# EAGLE design hwre (EAGLE 6.5.0)
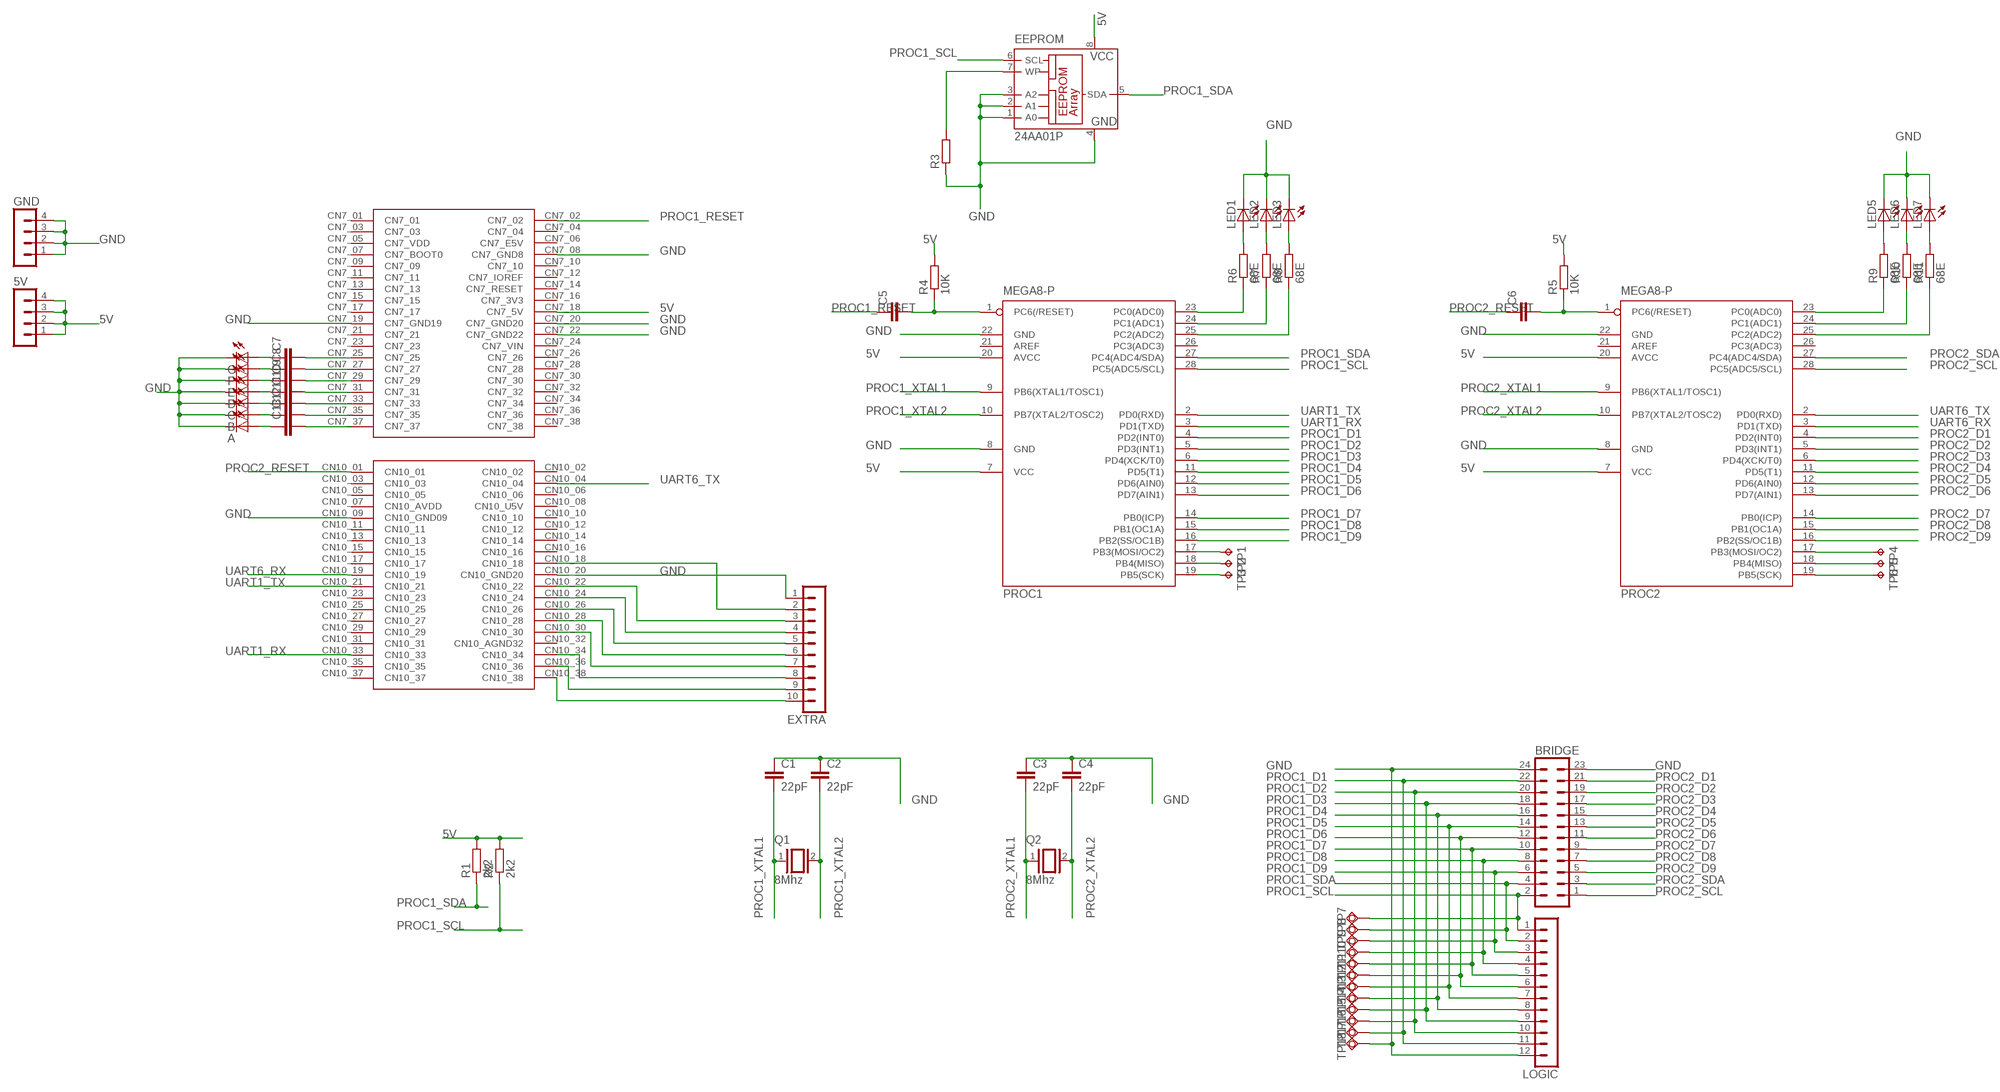
[diagram p0: schematic, sheet 1]

## Parts
5V  MA04-1  [MA04-1]
A  LEDCHIP-LED0603  [CHIP-LED0603]
B  LEDCHIP-LED0603  [CHIP-LED0603]
BRIDGE  MA12-2  [MA12-2]
C  LEDCHIP-LED0603  [CHIP-LED0603]
C1  22pF  C-EUC0603  [C0603]
C2  22pF  C-EUC0603  [C0603]
C3  22pF  C-EUC0603  [C0603]
C4  22pF  C-EUC0603  [C0603]
C5  C-EUC0603  [C0603]
C6  C-EUC0603  [C0603]
C7  C-EUC0603  [C0603]
C8  C-EUC0603  [C0603]
C9  C-EUC0603  [C0603]
C10  C-EUC0603  [C0603]
C11  C-EUC0603  [C0603]
C12  C-EUC0603  [C0603]
C13  C-EUC0603  [C0603]
D  LEDCHIP-LED0603  [CHIP-LED0603]
E  LEDCHIP-LED0603  [CHIP-LED0603]
EEPROM  24AA01P  [DIL8]
EXTRA  MA10-1  [MA10-1]
F  LEDCHIP-LED0603  [CHIP-LED0603]
G  LEDCHIP-LED0603  [CHIP-LED0603]
GND  MA04-1  [MA04-1]
LED1  LEDSML0805  [SML0805]
LED2  LEDSML0805  [SML0805]
LED3  LEDSML0805  [SML0805]
LED5  LEDSML0805  [SML0805]
LED6  LEDSML0805  [SML0805]
LED7  LEDSML0805  [SML0805]
LOGIC  MA12-1  [MA12-1]
PROC1  MEGA8-P  [DIL28-3]
PROC2  MEGA8-P  [DIL28-3]
Q1  8Mhz  XTAL/S  [QS]
Q2  8Mhz  XTAL/S  [QS]
R1  2k2  R-EU_R0603  [R0603]
R2  2k2  R-EU_R0603  [R0603]
R3  R-EU_R0603  [R0603]
R4  10K  R-EU_R0603  [R0603]
R5  10K  R-EU_R0603  [R0603]
R6  68E  R-EU_R0603  [R0603]
R7  68E  R-EU_R0603  [R0603]
R8  68E  R-EU_R0603  [R0603]
R9  68E  R-EU_R0603  [R0603]
R10  68E  R-EU_R0603  [R0603]
R11  68E  R-EU_R0603  [R0603]
TP1  TPTP20R  [TP20R]
TP2  TPTP20R  [TP20R]
TP3  TPTP20R  [TP20R]
TP4  TPTP20R  [TP20R]
TP5  TPTP20R  [TP20R]
TP6  TPTP20R  [TP20R]
TP7  TPSQTP20R  [TP20R]
TP8  TPSQTP20R  [TP20R]
TP9  TPSQTP20R  [TP20R]
TP10  TPSQTP20R  [TP20R]
TP11  TPSQTP20R  [TP20R]
TP12  TPSQTP20R  [TP20R]
TP13  TPSQTP20R  [TP20R]
TP14  TPSQTP20R  [TP20R]
TP15  TPSQTP20R  [TP20R]
TP16  TPSQTP20R  [TP20R]
TP17  TPSQTP20R  [TP20R]
TP18  TPSQTP20R  [TP20R]
U$1  NUCLEO_SHIELDGENERIC  [NUCLEO_SHIELD]

## Nets
5V: 5V.1 5V.2 5V.3 5V.4 EEPROM.8(VCC) PROC1.7(VCC) PROC1.20(AVCC) PROC2.7(VCC) PROC2.20(AVCC) R1.2 R2.2 R4.2 R5.2 U$1.CN7_18(CN7_5V)
GND: A.C B.C BRIDGE.23 BRIDGE.24 C1.1 C2.1 C3.1 C4.1 C.C D.C E.C EEPROM.1(A0) EEPROM.2(A1) EEPROM.3(A2) EEPROM.4(GND) EXTRA.1 F.C G.C GND.1 GND.2 GND.3 GND.4 LED1.C LED2.C LED3.C LED5.C LED6.C LED7.C LOGIC.12 PROC1.8(GND) PROC1.22(GND) PROC2.8(GND) PROC2.22(GND) R3.1 TP18.TP U$1.CN7_08(CN7_GND8) U$1.CN7_19(CN7_GND19) U$1.CN7_20(CN7_GND20) U$1.CN7_22(CN7_GND22) U$1.CN10_09(CN10_GND09) U$1.CN10_20(CN10_GND20)
N$1: PROC1.23(PC0(ADC0)) R6.1
N$2: PROC1.24(PC1(ADC1)) R7.1
N$3: PROC1.25(PC2(ADC2)) R8.1
N$4: LED1.A R6.2
N$5: LED2.A R7.2
N$6: EEPROM.7(WP) R3.2
N$7: LED3.A R8.2
N$8: PROC1.17(PB3(MOSI/OC2)) TP1.TP
N$9: PROC2.23(PC0(ADC0)) R9.1
N$10: PROC2.24(PC1(ADC1)) R10.1
N$11: PROC2.25(PC2(ADC2)) R11.1
N$12: LED5.A R9.2
N$13: LED6.A R10.2
N$14: LED7.A R11.2
N$15: PROC1.18(PB4(MISO)) TP2.TP
N$16: PROC1.19(PB5(SCK)) TP3.TP
N$17: PROC2.17(PB3(MOSI/OC2)) TP4.TP
N$18: PROC2.18(PB4(MISO)) TP5.TP
N$19: PROC2.19(PB5(SCK)) TP6.TP
N$20: C7.2 U$1.CN7_25
N$21: C8.2 U$1.CN7_27
N$22: C9.2 U$1.CN7_29
N$23: C10.2 U$1.CN7_31
N$24: C11.2 U$1.CN7_33
N$25: C12.2 U$1.CN7_35
N$26: C13.2 U$1.CN7_37
N$27: C7.1 G.A
N$28: C8.1 F.A
N$29: C9.1 E.A
N$30: C10.1 D.A
N$31: C11.1 C.A
N$32: B.A C12.1
N$33: A.A C13.1
N$34: EXTRA.10 U$1.CN10_38
N$35: EXTRA.9 U$1.CN10_36
N$36: EXTRA.8 U$1.CN10_34
N$37: EXTRA.7 U$1.CN10_30
N$38: EXTRA.6 U$1.CN10_28
N$39: EXTRA.5 U$1.CN10_26
N$40: EXTRA.4 U$1.CN10_24
N$41: EXTRA.3 U$1.CN10_22
N$42: EXTRA.2 U$1.CN10_18
PC6: C5.2 PROC1.1(PC6(/RESET)) R4.1
PROC1_D1: BRIDGE.22 LOGIC.11 PROC1.4(PD2(INT0)) TP17.TP
PROC1_D2: BRIDGE.20 LOGIC.10 PROC1.5(PD3(INT1)) TP16.TP
PROC1_D3: BRIDGE.18 LOGIC.9 PROC1.6(PD4(XCK/T0)) TP15.TP
PROC1_D4: BRIDGE.16 LOGIC.8 PROC1.11(PD5(T1)) TP14.TP
PROC1_D5: BRIDGE.14 LOGIC.7 PROC1.12(PD6(AIN0)) TP13.TP
PROC1_D6: BRIDGE.12 LOGIC.6 PROC1.13(PD7(AIN1)) TP12.TP
PROC1_D7: BRIDGE.10 LOGIC.5 PROC1.14(PB0(ICP)) TP11.TP
PROC1_D8: BRIDGE.8 LOGIC.4 PROC1.15(PB1(OC1A)) TP10.TP
PROC1_D9: BRIDGE.6 LOGIC.3 PROC1.16(PB2(SS/OC1B)) TP9.TP
PROC1_RESET: C5.1 U$1.CN7_02
PROC1_SCL: BRIDGE.2 EEPROM.6(SCL) LOGIC.1 PROC1.28(PC5(ADC5/SCL)) R2.1 TP7.TP
PROC1_SDA: BRIDGE.4 EEPROM.5(SDA) LOGIC.2 PROC1.27(PC4(ADC4/SDA)) R1.1 TP8.TP
PROC1_XTAL1: C1.2 PROC1.9(PB6(XTAL1/TOSC1)) Q1.1
PROC1_XTAL2: C2.2 PROC1.10(PB7(XTAL2/TOSC2)) Q1.2
PROC2_D1: BRIDGE.21 PROC2.4(PD2(INT0))
PROC2_D2: BRIDGE.19 PROC2.5(PD3(INT1))
PROC2_D3: BRIDGE.17 PROC2.6(PD4(XCK/T0))
PROC2_D4: BRIDGE.15 PROC2.11(PD5(T1))
PROC2_D5: BRIDGE.13 PROC2.12(PD6(AIN0))
PROC2_D6: BRIDGE.11 PROC2.13(PD7(AIN1))
PROC2_D7: BRIDGE.9 PROC2.14(PB0(ICP))
PROC2_D8: BRIDGE.7 PROC2.15(PB1(OC1A))
PROC2_D9: BRIDGE.5 PROC2.16(PB2(SS/OC1B))
PROC2_PC6: C6.2 PROC2.1(PC6(/RESET)) R5.1
PROC2_RESET: C6.1 U$1.CN10_01
PROC2_SCL: BRIDGE.1 PROC2.28(PC5(ADC5/SCL))
PROC2_SDA: BRIDGE.3 PROC2.27(PC4(ADC4/SDA))
PROC2_XTAL1: C3.2 PROC2.9(PB6(XTAL1/TOSC1)) Q2.1
PROC2_XTAL2: C4.2 PROC2.10(PB7(XTAL2/TOSC2)) Q2.2
UART1_RX: PROC1.3(PD1(TXD)) U$1.CN10_33
UART1_TX: PROC1.2(PD0(RXD)) U$1.CN10_21
UART6_RX: PROC2.3(PD1(TXD)) U$1.CN10_19
UART6_TX: PROC2.2(PD0(RXD)) U$1.CN10_04
Unconnected: PROC1.21(AREF) PROC1.26(PC3(ADC3)) PROC2.21(AREF) PROC2.26(PC3(ADC3)) U$1.CN7_01 U$1.CN7_03 U$1.CN7_04 U$1.CN7_05(CN7_VDD) U$1.CN7_06(CN7_E5V) U$1.CN7_07(CN7_BOOT0) U$1.CN7_09 U$1.CN7_10 U$1.CN7_11 U$1.CN7_12(CN7_IOREF) U$1.CN7_13 U$1.CN7_14(CN7_RESET) U$1.CN7_15 U$1.CN7_16(CN7_3V3) U$1.CN7_17 U$1.CN7_21 U$1.CN7_23 U$1.CN7_24(CN7_VIN) U$1.CN7_26 U$1.CN7_28 U$1.CN7_30 U$1.CN7_32 U$1.CN7_34 U$1.CN7_36 U$1.CN7_38 U$1.CN10_02 U$1.CN10_03 U$1.CN10_05 U$1.CN10_06 U$1.CN10_07(CN10_AVDD) U$1.CN10_08(CN10_U5V) U$1.CN10_10 U$1.CN10_11 U$1.CN10_12 U$1.CN10_13 U$1.CN10_14 U$1.CN10_15 U$1.CN10_16 U$1.CN10_17 U$1.CN10_23 U$1.CN10_25 U$1.CN10_27 U$1.CN10_29 U$1.CN10_31 U$1.CN10_32(CN10_AGND32) U$1.CN10_35 U$1.CN10_37

## Library data of the parts
5V GND = con-lstb:MA04-1: PIN HEADER; OC_FARNELL: unknown; OC_NEWARK: unknown
A B C D E F G LED1-LED3 LED5-LED7 = led:LED: LED OSRAM: - CHIPLED LG R971, LG N971, LY N971, LG Q971, LY Q971, LO R971, LY R971 LH N974, LH R974 LS Q976, LO Q976, LY Q976 LO Q996 - Hyper CHIPLED LW Q18S LB Q993, LB Q99A, LB R99A - SideLED LS A670, LO A670, LY A670, LG A670, LP A670 LB A673, LV A673, LT A673, LW A673 LH A674 LY A675 LS A676, LA A676, LO A676, LY A676, LW A676 LS A679, LY A679, LG A679 - Hyper Micro SIDELED® LS Y876, LA Y876, LO Y876, LY Y876 LT Y87S - SmartLED LW L88C, LW L88S LB L89C, LB L89S, LG L890 LS L89K, LO L89K, LY L89K LS L896, LA L896, LO L896, LY L896 - TOPLED LS T670, LO T670, LY T670, LG T670, LP T670 LSG T670, LSP T670, LSY T670, LOP T670, LYG T670 LG T671, LOG T671, LSG T671 LB T673, LV T673, LT T673, LW T673 LH T674 LS T676, LA T676, LO T676, LY T676, LB T676, LH T676, LSB T676, LW T676 LB T67C, LV T67C, LT T67C, LS T67K, LO T67K, LY T67K, LW E67C LS E67B, LA E67B, LO E67B, LY E67B, LB E67C, LV E67C, LT E67C LW T67C LS T679, LY T679, LG T679 LS T770, LO T770, LY T770, LG T770, LP T770 LB T773, LV T773, LT T773, LW T773 LH T774 LS E675, LA E675, LY E675, LS T675 LS T776, LA T776, LO T776, LY T776, LB T776 LHGB T686 LT T68C, LB T68C - Hyper Mini TOPLED® LB M676 - Mini TOPLED Santana® LG M470 LS M47K, LO M47K, LY M47K Source: http://www.osram.convergy.de LUXEON: - LUMILED® LXK2-PW12-R00, LXK2-PW12-S00, LXK2-PW14-U00, LXK2-PW14-V00 LXK2-PM12-R00, LXK2-PM12-S00, LXK2-PM14-U00 LXK2-PE12-Q00, LXK2-PE12-R00, LXK2-PE12-S00, LXK2-PE14-T00, LXK2-PE14-U00 LXK2-PB12-K00, LXK2-PB12-L00, LXK2-PB12-M00, LXK2-PB14-N00, LXK2-PB14-P00, LXK2-PB14-Q00 LXK2-PR12-L00, LXK2-PR12-M00, LXK2-PR14-Q00, LXK2-PR14-R00 LXK2-PD12-Q00, LXK2-PD12-R00, LXK2-PD12-S00 LXK2-PH12-R00, LXK2-PH12-S00 LXK2-PL12-P00, LXK2-PL12-Q00, LXK2-PL12-R00 Source: www.luxeon.com KINGBRIGHT: KA-3528ASYC Source: www.kingbright.com
BRIDGE = con-lstb:MA12-2: PIN HEADER; OC_FARNELL: unknown; OC_NEWARK: unknown
C1-C13 = rcl:C-EU: CAPACITOR, European symbol
EEPROM = microchip:24*: Serial EEPROM I2C; MPN: 24AA01-I/P; OC_FARNELL: 1331266; OC_NEWARK: 35M0692
EXTRA = con-lstb:MA10-1: PIN HEADER; OC_FARNELL: unknown; OC_NEWARK: unknown
LOGIC = con-lstb:MA12-1: PIN HEADER; OC_FARNELL: unknown; OC_NEWARK: unknown
PROC1 PROC2 = atmel:MEGA8-P: MICROCONTROLLER 8 Kbytes FLASH, 1 kbytes SRAM, 512 bytes EEPROM, USART, 4-channel 10 bit ADC, 2-channel 8 bit ADC Pin compatible with Atmega48, ATMega88, ATMega168 Source: avr.lbr; OC_FARNELL: unknown; OC_NEWARK: unknown
Q1 Q2 = special:XTAL/S: CRYSTAL
R1 R2 R6-R11 = rcl:R-EU_: RESISTOR, European symbol
R3-R5 = resistor:R-EU_: RESISTOR, European symbol
TP1-TP6 = testpad:TP: Test pad
TP7-TP18 = testpad:TPSQ: Test pad
U$1 = protofactory:NUCLEO_SHIELD: Generic Nucleo Shield

## Board
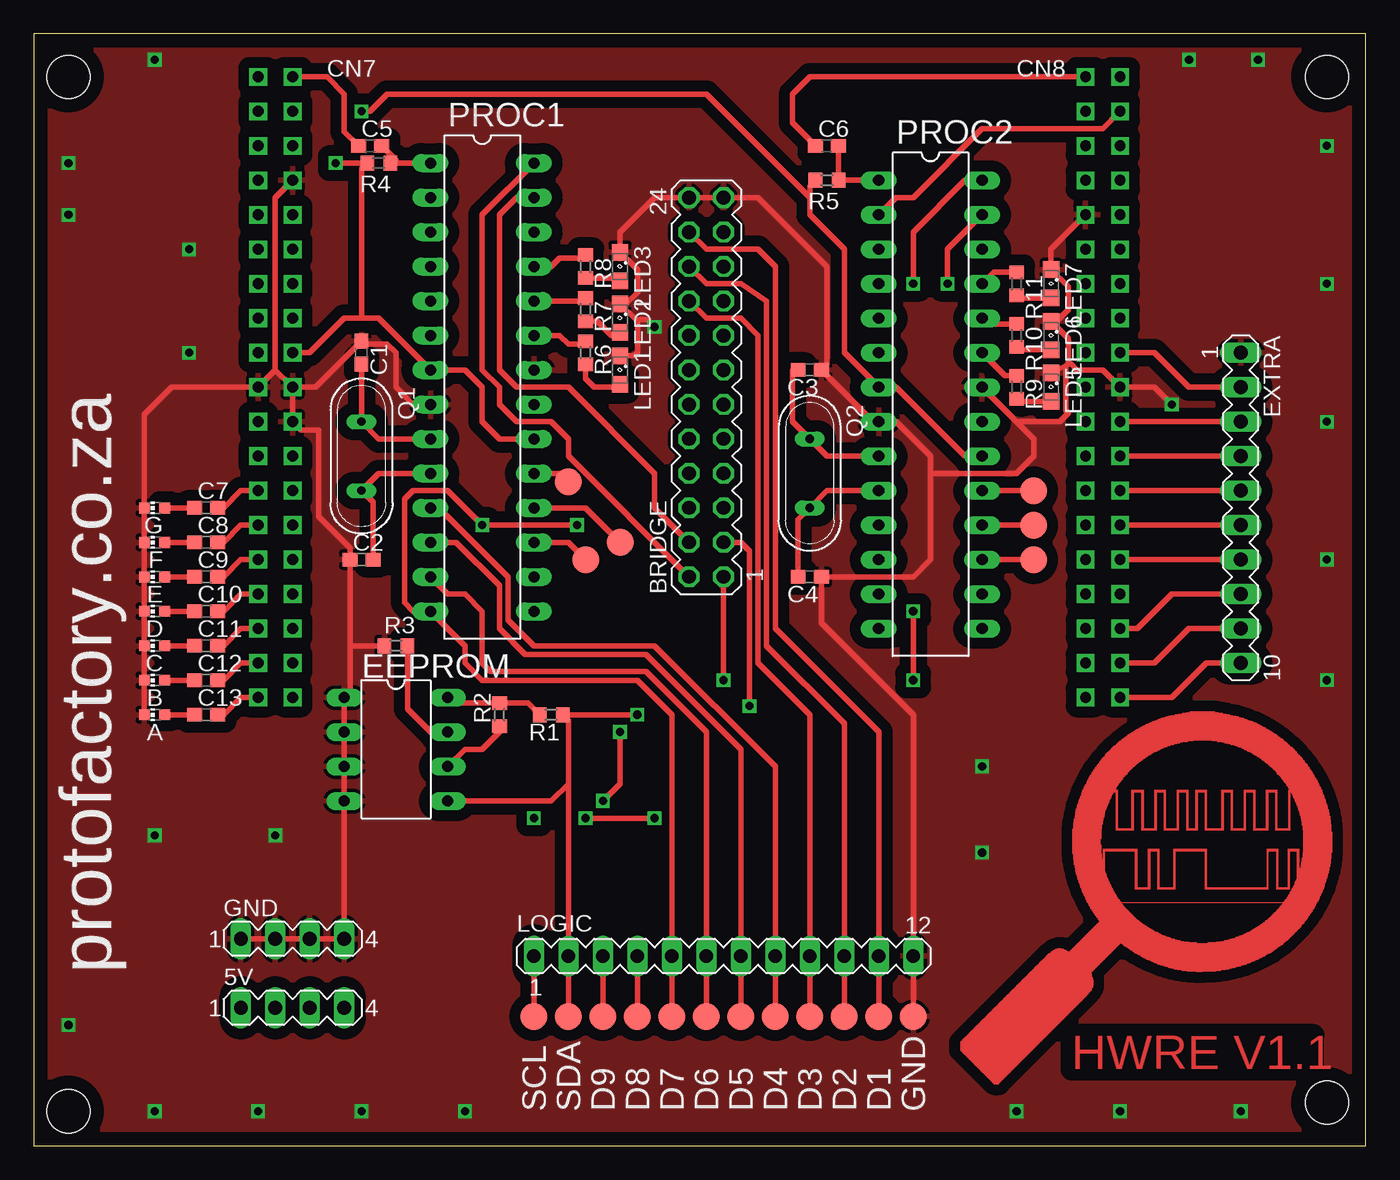
[diagram p1: board, top side]
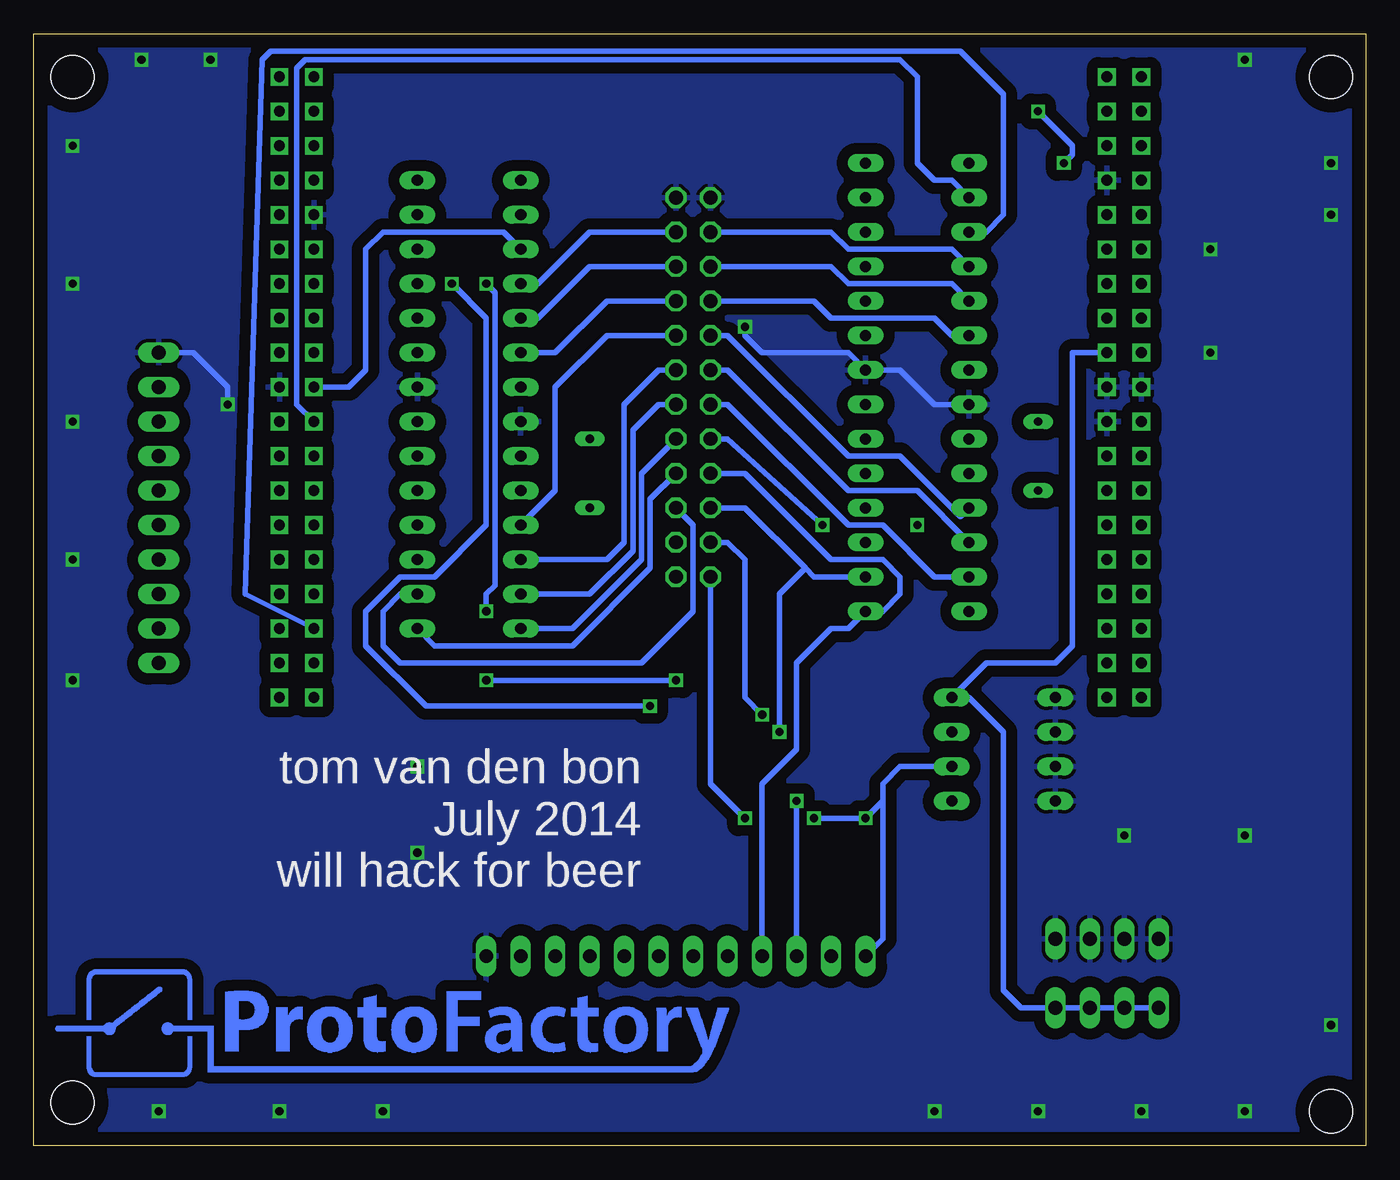
[diagram p2: board, bottom side, seen from below]

Size 98.09 x 81.91 mm. Coordinates in mm from the lower left corner, seen from the top.
Outline: 0,0 98.09,0 98.09,81.91 0,81.91 0,0
Copper layers (1*16): Top 0.035mm / dielectric 1.5mm / Bottom 0.035mm
Design rules "default": minimum track width 10mil, minimum drill 24mil, track to track 8mil, track to pad 8mil, pad to pad 8mil, via to via 8mil, smd to smd 8mil, copper to edge 40mil, drill to drill 8mil, minimum pad ring 10mil, minimum via ring 8mil, stop-mask expansion 4mil, vias tented up to drill 0mil, thermal gap 10mil
Holes 3.2 mm at 95.25,78.74 95.25,3.17 2.54,78.74 2.54,2.54

### Footprints (pad centres in the part's own frame; a part is rotated, then mirrored left to right if it is on the bottom)
MA04-1 = drill 1.016 long: 1 -3.81,0; 2 -1.27,0; 3 1.27,0; 4 3.81,0
CHIP-LED0603 = smd 0.8 x 0.8: A 0,-0.75; C 0,0.75
MA12-2 = drill 1.016 octagon: 1 -13.97,-1.27; 2 -13.97,1.27; 3 -11.43,-1.27; 4 -11.43,1.27; 5 -8.89,-1.27; 6 -8.89,1.27; 7 -6.35,-1.27; 8 -6.35,1.27; 9 -3.81,-1.27; 10 -3.81,1.27; 11 -1.27,-1.27; 12 -1.27,1.27; 13 1.27,-1.27; 14 1.27,1.27; 15 3.81,-1.27; 16 3.81,1.27; 17 6.35,-1.27; 18 6.35,1.27; 19 8.89,-1.27; 20 8.89,1.27; 21 11.43,-1.27; 22 11.43,1.27; 23 13.97,-1.27; 24 13.97,1.27
C0603 = smd 1.1 x 1: 1 -0.85,0; 2 0.85,0
DIL8 = drill 0.813 long: 1 -3.81,-3.81; 2 -1.27,-3.81; 3 1.27,-3.81; 4 3.81,-3.81; 5 3.81,3.81; 6 1.27,3.81; 7 -1.27,3.81; 8 -3.81,3.81
MA10-1 = drill 1.016 long: 1 -11.43,0; 2 -8.89,0; 3 -6.35,0; 4 -3.81,0; 5 -1.27,0; 6 1.27,0; 7 3.81,0; 8 6.35,0; 9 8.89,0; 10 11.43,0
SML0805 = smd 1.2 x 1.2: A 1.05,0; C -1.05,0
MA12-1 = drill 1.016 long: 1 -13.97,0; 2 -11.43,0; 3 -8.89,0; 4 -6.35,0; 5 -3.81,0; 6 -1.27,0; 7 1.27,0; 8 3.81,0; 9 6.35,0; 10 8.89,0; 11 11.43,0; 12 13.97,0
DIL28-3 = drill 0.813 long: 1 -16.51,-3.81; 2 -13.97,-3.81; 3 -11.43,-3.81; 4 -8.89,-3.81; 5 -6.35,-3.81; 6 -3.81,-3.81; 7 -1.27,-3.81; 8 1.27,-3.81; 9 3.81,-3.81; 10 6.35,-3.81; 11 8.89,-3.81; 12 11.43,-3.81; 13 13.97,-3.81; 14 16.51,-3.81; 15 16.51,3.81; 16 13.97,3.81; 17 11.43,3.81; 18 8.89,3.81; 19 6.35,3.81; 20 3.81,3.81; 21 1.27,3.81; 22 -1.27,3.81; 23 -3.81,3.81; 24 -6.35,3.81; 25 -8.89,3.81; 26 -11.43,3.81; 27 -13.97,3.81; 28 -16.51,3.81
QS = drill 0.61 long: 1 -2.54,0; 2 2.54,0
R0603 = smd 1 x 1.1: 1 -0.85,0; 2 0.85,0
TP20R = smd 2 x 2: TP 0,0
NUCLEO_SHIELD = drill 0.8 square: CN7_01 -33.02,22.86; CN7_02 -30.48,22.86; CN7_03 -33.02,20.32; CN7_04 -30.48,20.32; CN7_05 -33.02,17.78; CN7_06 -30.48,17.78; CN7_07 -33.02,15.24; CN7_08 -30.48,15.24; CN7_09 -33.02,12.7; CN7_10 -30.48,12.7; CN7_11 -33.02,10.16; CN7_12 -30.48,10.16; CN7_13 -33.02,7.62; CN7_14 -30.48,7.62; CN7_15 -33.02,5.08; CN7_16 -30.48,5.08; CN7_17 -33.02,2.54; CN7_18 -30.48,2.54; CN7_19 -33.02,0; CN7_20 -30.48,0; CN7_21 -33.02,-2.54; CN7_22 -30.48,-2.54; CN7_23 -33.02,-5.08; CN7_24 -30.48,-5.08; CN7_25 -33.02,-7.62; CN7_26 -30.48,-7.62; CN7_27 -33.02,-10.16; CN7_28 -30.48,-10.16; CN7_29 -33.02,-12.7; CN7_30 -30.48,-12.7; CN7_31 -33.02,-15.24; CN7_32 -30.48,-15.24; CN7_33 -33.02,-17.78; CN7_34 -30.48,-17.78; CN7_35 -33.02,-20.32; CN7_36 -30.48,-20.32; CN7_37 -33.02,-22.86; CN7_38 -30.48,-22.86; CN10_01 27.94,22.86; CN10_02 30.48,22.86; CN10_03 27.94,20.32; CN10_04 30.48,20.32; CN10_05 27.94,17.78; CN10_06 30.48,17.78; CN10_07 27.94,15.24; CN10_08 30.48,15.24; CN10_09 27.94,12.7; CN10_10 30.48,12.7; CN10_11 27.94,10.16; CN10_12 30.48,10.16; CN10_13 27.94,7.62; CN10_14 30.48,7.62; CN10_15 27.94,5.08; CN10_16 30.48,5.08; CN10_17 27.94,2.54; CN10_18 30.48,2.54; CN10_19 27.94,0; CN10_20 30.48,0; CN10_21 27.94,-2.54; CN10_22 30.48,-2.54; CN10_23 27.94,-5.08; CN10_24 30.48,-5.08; CN10_25 27.94,-7.62; CN10_26 30.48,-7.62; CN10_27 27.94,-10.16; CN10_28 30.48,-10.16; CN10_29 27.94,-12.7; CN10_30 30.48,-12.7; CN10_31 27.94,-15.24; CN10_32 30.48,-15.24; CN10_33 27.94,-17.78; CN10_34 30.48,-17.78; CN10_35 27.94,-20.32; CN10_36 30.48,-20.32; CN10_37 27.94,-22.86; CN10_38 30.48,-22.86

### Placement (x,y rotation side)
5V  19.05,10.16 0 top
A  8.89,31.75 90 top
B  8.89,34.29 90 top
BRIDGE  49.53,55.88 90 top
C  8.89,36.83 90 top
C1  24.13,58.42 270 top
C2  24.13,43.18 0 top
C3  57.15,57.15 180 top
C4  57.15,41.91 180 top
C5  24.77,73.66 0 top
C6  58.42,73.66 0 top
C7  12.7,46.99 0 top
C8  12.7,44.45 0 top
C9  12.7,41.91 0 top
C10  12.7,39.37 0 top
C11  12.7,36.83 0 top
C12  12.7,34.29 0 top
C13  12.7,31.75 0 top
D  8.89,39.37 90 top
E  8.89,41.91 90 top
EEPROM  26.67,29.21 270 top
EXTRA  88.9,46.99 270 top
F  8.89,44.45 90 top
G  8.89,46.99 90 top
GND  19.05,15.24 0 top
LED1  43.18,57.15 270 top
LED2  43.18,60.96 270 top
LED3  43.18,64.77 270 top
LED5  74.93,55.88 270 top
LED6  74.93,59.69 270 top
LED7  74.93,63.5 270 top
LOGIC  50.8,13.97 0 top
PROC1  33.02,55.88 270 top
PROC2  66.04,54.61 270 top
Q1  24.13,50.8 270 top
Q2  57.15,49.53 270 top
R1  38.1,31.75 180 top
R2  34.29,31.75 90 top
R3  26.67,36.83 0 top
R4  25.4,72.39 180 top
R5  58.42,71.12 180 top
R6  40.64,58.42 270 top
R7  40.64,61.59 270 top
R8  40.64,64.77 270 top
R9  72.39,55.88 270 top
R10  72.39,59.69 270 top
R11  72.39,63.5 270 top
TP1  40.64,43.18 0 top
TP2  43.18,44.45 0 top
TP3  39.37,48.9 0 top
TP4  73.66,43.18 0 top
TP5  73.66,45.72 0 top
TP6  73.66,48.26 0 top
TP7  36.83,9.53 0 top
TP8  39.37,9.53 0 top
TP9  41.91,9.53 0 top
TP10  44.45,9.53 0 top
TP11  46.99,9.53 0 top
TP12  49.53,9.53 0 top
TP13  52.07,9.53 0 top
TP14  54.61,9.53 0 top
TP15  57.15,9.53 0 top
TP16  59.69,9.53 0 top
TP17  62.23,9.53 0 top
TP18  64.77,9.53 0 top
U$1  49.53,55.88 0 top
U$2  [HWRE]  67.31,3.81 0 top
U$3  [LOGO]  96.52,5.08 0 bottom

### Tracks (layer width: path | path; a pad name or v marks a point on that pad's centre or on a via)
5V  (via drill 0.6)
  Top 0.406: PROC2.20 68.58,50.8 63.5,55.88 PROC2.7 59.69,58.42 59.69,66.04 57.15,68.58 57.15,69.85 | 57.15,69.85 57.15,70.7 R5.2 | 24.13,60.96 25.4,60.96 PROC1.7 31.75,57.15 33.02,55.88 33.02,53.34 34.29,52.07 PROC1.20 | R4.2 24.13,71.97 24.13,60.96 | 57.15,69.85 49.53,77.47 26.04,77.47 24.77,76.2 v24.13,76.2 | 24.77,72.61 R4.2 | EEPROM.8 30.9,32.6 R2.2 36.4,32.6 R1.2 | U$1.CN7_18 20.32,58.42 22.86,60.96 24.13,60.96 | v22.23,72.39 R4.2
  Bottom 0.406: U$1.CN7_18 21.59,58.42 21.59,36.83 22.86,35.56 27.94,35.56 EEPROM.8 29.21,33.02 26.67,30.48 26.67,11.43 25.4,10.16 5V.4 5V.3 5V.2 5V.1 | v24.13,76.2 21.59,73.66 21.59,73.03 v22.23,72.39
GND  (via drill 0.6)
  Top 0.406: LED5.C 76.03,57.48 | 76.03,57.48 76.2,57.56 | 76.2,57.56 76.2,59.47 LED6.C 75.34,60.74 76.2,61.59 76.2,63.28 LED7.C 74.93,66.04 U$1.CN10_09 | U$1.CN7_20 20.74,55.88 C1.1 24.34,59.05 26.04,59.05 26.67,58.42 26.67,55.88 27.94,54.61 PROC1.8 | U$1.CN7_08 17.78,69.85 17.78,57.15 | 17.78,57.15 U$1.CN7_20 | 17.78,57.15 U$1.CN7_19 10.16,55.88 8.14,53.86 G.C F.C E.C D.C C.C B.C A.C | U$1.CN7_20 U$1.CN7_22 19.68,52.7 20.95,52.7 20.95,46.35 23.28,44.03 C2.1 23.28,36.83 | LED1.C 44.23,58.2 44.45,58.42 44.45,60.74 44.34,60.85 | 44.34,60.85 LED2.C 43.59,62.01 44.45,62.87 44.45,64.55 LED3.C 43.18,67.31 45.72,69.85 BRIDGE.24 BRIDGE.23 53.34,69.85 58.42,64.77 58.42,57.57 C3.1 61.81,53.34 PROC2.8 63.5,53.34 66.04,50.8 66.04,49.53 | 23.28,36.83 23.28,33.44 EEPROM.1 EEPROM.2 EEPROM.3 EEPROM.4 GND.4 GND.3 GND.2 GND.1 | R3.1 23.28,36.83 | v45.72,60.33 45.2,60.85 44.34,60.85 | 76.2,57.56 76.42,57.56 76.83,57.15 78.74,57.15 U$1.CN10_20 82.55,55.88 v83.82,54.61 | 76.03,57.48 76.03,54.14 76.2,53.98 75.56,53.34 72.39,53.34 PROC2.22 73.66,52.07 73.66,50.8 72.39,49.53 66.04,49.53 | 66.04,49.53 66.04,43.18 64.77,41.91 C4.1 58,38.52 64.77,31.75 LOGIC.12 TP18.TP
  Bottom 0.406: PROC1.8 31.75,54.61 34.29,57.15 PROC1.22 38.1,58.42 44.45,58.42 45.72,59.69 v45.72,60.33 | v83.82,54.61 83.82,55.88 86.36,58.42 EXTRA.1
  other vias: 8.89,80.01 2.54,72.39 2.54,68.58 11.43,66.04 11.43,58.42 8.89,22.86 17.78,22.86 2.54,8.89 8.89,2.54 16.51,2.54 24.13,2.54 31.75,2.54 69.85,27.94 69.85,21.59 72.39,2.54 80.01,2.54 88.9,2.54 95.25,34.29 95.25,43.18 95.25,53.34 95.25,63.5 95.25,73.66 90.17,80.01 85.09,80.01
  pour Bottom (isolate 0.813): 0,81.28 97.79,81.28 97.79,0 0,0
  pour Top (isolate 0.813): 0,82.55 99.06,82.55 99.06,0 0,0
N$1
  Top 0.406: PROC1.23 38.73,59.69 39.37,59.05 40.42,59.05 R6.1
N$2
  Top 0.406: PROC1.24 40.42,62.23 R7.1
N$3
  Top 0.406: PROC1.25 38.1,64.77 38.73,65.41 40.42,65.41 R8.1
N$4
  Top 0.406: R6.2 40.64,56.52 41.27,55.88 42.96,55.88 LED1.A
N$5
  Top 0.406: R7.2 41.49,60.74 42.55,59.69 42.96,59.69 LED2.A
N$6
  Top 0.406: R3.2 27.52,32.17 29.21,30.48 EEPROM.7
N$7
  Top 0.406: R8.2 42.98,63.92 LED3.A
N$8
  Top 0.406: PROC1.17 39.37,44.45 TP1.TP
N$9
  Top 0.406: PROC2.23 71.54,56.73 R9.1
N$10
  Top 0.406: PROC2.24 70.27,60.54 R10.1
N$11
  Top 0.406: PROC2.25 70.7,64.35 R11.1
N$12
  Top 0.406: R9.2 72.59,54.83 LED5.A
N$13
  Top 0.406: R10.2 72.59,58.64 LED6.A
N$14
  Top 0.406: R11.2 72.59,62.45 LED7.A
N$15
  Top 0.406: PROC1.18 40.64,46.99 TP2.TP
N$16
  Top 0.406: PROC1.19 38.73,49.53 TP3.TP
N$17
  Top 0.406: TP4.TP PROC2.17
N$18
  Top 0.406: TP5.TP PROC2.18
N$19
  Top 0.406: TP6.TP PROC2.19
N$20
  Top 0.406: C7.2 13.97,46.99 15.24,48.26 U$1.CN7_25
N$21
  Top 0.406: C8.2 13.97,44.45 15.24,45.72 U$1.CN7_27
N$22
  Top 0.406: C9.2 13.97,41.91 15.24,43.18 U$1.CN7_29
N$23
  Top 0.406: C10.2 13.97,39.37 15.24,40.64 U$1.CN7_31
N$24
  Top 0.406: C11.2 13.97,36.83 15.24,38.1 U$1.CN7_33
N$25
  Top 0.406: C12.2 13.97,34.29 15.24,35.56 U$1.CN7_35
N$26
  Top 0.406: C13.2 13.97,31.75 15.24,33.02 U$1.CN7_37
N$27
  Top 0.406: C7.1 G.A
N$28
  Top 0.406: C8.1 F.A
N$29
  Top 0.406: C9.1 E.A
N$30
  Top 0.406: C10.1 D.A
N$31
  Top 0.406: C11.1 C.A
N$32
  Top 0.406: C12.1 B.A
N$33
  Top 0.406: C13.1 A.A
N$34
  Top 0.406: U$1.CN10_38 83.82,33.02 86.36,35.56 EXTRA.10
N$35
  Top 0.406: U$1.CN10_36 82.55,35.56 85.09,38.1 EXTRA.9
N$36
  Top 0.406: U$1.CN10_34 81.28,38.1 83.82,40.64 EXTRA.8
N$37
  Top 0.406: U$1.CN10_30 EXTRA.7
N$38
  Top 0.406: U$1.CN10_28 EXTRA.6
N$39
  Top 0.406: EXTRA.5 U$1.CN10_26
N$40
  Top 0.406: EXTRA.4 U$1.CN10_24
N$41
  Top 0.406: EXTRA.3 U$1.CN10_22
N$42
  Top 0.406: U$1.CN10_18 82.55,58.42 85.09,55.88 EXTRA.2
PC6
  Top 0.406: 26.67,72.39 PROC1.1 | R4.1 26.67,72.39 | 26.67,72.39 26.67,72.61 C5.2
PROC1_D1
  Top 0.406: BRIDGE.22 49.53,66.04 53.34,66.04 54.61,64.77 54.61,38.1 62.23,30.48 LOGIC.11 TP17.TP
  Bottom 0.406: BRIDGE.22 39.37,67.31 38.1,66.04 30.48,66.04 PROC1.4
PROC1_D2
  Top 0.406: BRIDGE.20 49.53,63.5 52.07,63.5 53.98,62.23 53.98,36.83 59.69,31.11 LOGIC.10 TP16.TP
  Bottom 0.406: BRIDGE.20 39.37,64.77 38.1,63.5 30.48,63.5 PROC1.5
PROC1_D3
  Top 0.406: BRIDGE.18 49.53,60.96 52.07,60.96 53.34,59.69 53.34,35.56 57.15,31.75 LOGIC.9 TP15.TP
  Bottom 0.406: BRIDGE.18 40.64,62.23 39.37,60.96 31.75,60.96 30.48,59.69 PROC1.6
PROC1_D4
  Top 0.406: PROC1.11 29.84,46.99 34.92,41.91 34.92,38.73 36.83,36.83 45.72,36.83 54.61,27.94 LOGIC.8 TP14.TP
  Bottom 0.406: BRIDGE.16 46.99,59.69 38.1,50.8 34.29,50.8 29.84,46.35 PROC1.11
PROC1_D5
  Top 0.406: PROC1.12 31.11,44.45 34.29,41.27 34.29,38.1 36.2,36.2 45.09,36.2 52.07,29.21 LOGIC.7 TP13.TP
  Bottom 0.406: BRIDGE.14 46.99,57.15 38.1,48.26 33.02,48.26 PROC1.12
PROC1_D6
  Top 0.406: PROC1.13 30.48,40.64 31.75,40.64 33.02,39.37 33.02,35.56 33.66,34.92 45.09,34.92 49.53,30.48 LOGIC.6 TP12.TP
  Bottom 0.406: BRIDGE.12 46.99,54.61 38.1,45.72 35.56,45.72 31.75,41.91 PROC1.13
PROC1_D7  (via drill 0.6)
  Top 0.406: v40.01,45.72 v33.02,45.72 30.48,48.26 27.94,48.26 27.3,47.62 27.3,40.01 27.94,39.37 PROC1.14 31.75,36.83 31.75,35.56 33.02,34.29 44.45,34.29 46.99,31.75 LOGIC.5 TP11.TP
  Bottom 0.406: BRIDGE.10 46.99,52.07 v40.01,45.72
PROC1_D8
  Top 0.406: LOGIC.4 TP10.TP
  Bottom 0.406: BRIDGE.8 45.72,49.53 39.37,43.18 35.56,43.18 34.29,41.91 34.29,40.64 35.56,39.37 PROC1.15 38.1,38.1 39.37,38.1 41.91,35.56 41.91,29.21 44.45,26.67 LOGIC.4
PROC1_D9  (via drill 0.6)
  Top 0.406: v41.91,25.4 43.18,26.67 v43.18,30.48 | LOGIC.3 TP9.TP
  Bottom 0.406: BRIDGE.6 45.72,46.99 41.27,42.55 | 41.27,42.55 40.64,41.91 PROC1.16 | LOGIC.3 v41.91,25.4 | v43.18,30.48 43.18,40.64 41.27,42.55
PROC1_RESET
  Top 0.406: C5.1 22.86,74.72 22.86,77.47 21.59,78.74 U$1.CN7_02
PROC1_SCL  (via drill 0.6)
  Top 0.406: PROC1.28 33.02,68.58 33.02,57.15 34.29,55.88 34.29,54.61 35.56,53.34 38.1,53.34 39.37,52.07 39.37,50.8 BRIDGE.2 | R2.1 34.29,30.48 33.02,29.21 31.75,29.21 EEPROM.6 | LOGIC.1 TP7.TP | v45.72,24.13 v40.64,24.13
  Bottom 0.406: EEPROM.6 34.29,27.94 35.56,26.67 35.56,25.4 | 35.56,25.4 35.56,15.24 LOGIC.1 | BRIDGE.2 48.26,26.67 v45.72,24.13 | 35.56,25.4 v36.83,24.13 v40.64,24.13
PROC1_SDA  (via drill 0.6)
  Top 0.406: PROC1.27 35.56,69.85 34.29,68.58 34.29,57.15 35.56,55.88 39.37,55.88 45.72,49.53 45.72,46.99 BRIDGE.4 | v44.45,31.75 R1.1 39.37,31.33 39.37,26.67 | 39.37,26.67 LOGIC.2 TP8.TP | EEPROM.5 38.1,25.4 39.37,26.67
  Bottom 0.406: v44.45,31.75 45.72,33.02 45.72,43.18 46.99,44.45 BRIDGE.4
PROC1_XTAL1
  Top 0.406: PROC1.9 25.4,52.07 Q1.1 C1.2
PROC1_XTAL2
  Top 0.406: C2.2 24.98,47.41 Q1.2 25.4,49.53 PROC1.10
PROC2_D1
  Bottom 0.406: BRIDGE.21 57.15,67.31 60.96,63.5 PROC2.4
PROC2_D2
  Bottom 0.406: BRIDGE.19 57.15,64.77 60.96,60.96 PROC2.5
PROC2_D3
  Bottom 0.406: BRIDGE.17 55.88,62.23 59.69,58.42 PROC2.6
PROC2_D4
  Bottom 0.406: BRIDGE.15 55.88,59.69 59.69,55.88 59.69,48.26 PROC2.11
PROC2_D5
  Bottom 0.406: BRIDGE.13 52.07,57.15 54.61,54.61 54.61,44.45 55.88,43.18 PROC2.12
PROC2_D6
  Bottom 0.406: BRIDGE.11 52.07,54.61 53.98,52.7 53.98,43.81 57.15,40.64 PROC2.13
PROC2_D7
  Bottom 0.406: BRIDGE.9 53.34,49.53 53.34,43.18 58.42,38.1 PROC2.14
PROC2_D8
  Bottom 0.406: BRIDGE.7 52.7,47.62 52.7,42.55 58.42,36.83 68.58,36.83 PROC2.15
PROC2_D9
  Bottom 0.406: BRIDGE.5 49.53,45.72 49.53,39.37 53.34,35.56 71.12,35.56 72.39,36.83 72.39,39.37 71.12,40.64 PROC2.16
PROC2_PC6
  Top 0.406: PROC2.1 R5.1 C6.2
PROC2_RESET
  Top 0.406: C6.1 55.88,75.35 55.88,77.47 57.15,78.74 U$1.CN10_01
PROC2_SCL  (via drill 0.6)
  Top 0.406: BRIDGE.1 v50.8,34.29 | v64.77,34.29 v64.77,39.37 | v64.77,63.5 64.77,67.31 68.58,71.12 PROC2.28
  Bottom 0.406: v50.8,34.29 v64.77,34.29 | v64.77,39.37 64.77,40.64 64.14,41.27 64.14,62.87 v64.77,63.5
PROC2_SDA  (via drill 0.6)
  Top 0.406: BRIDGE.3 52.07,44.45 52.7,43.81 v52.7,32.38 | v67.31,63.5 67.31,66.04 PROC2.27
  Bottom 0.406: v52.7,32.38 69.22,32.38 73.66,36.83 73.66,39.37 71.12,41.91 68.58,41.91 64.77,45.72 64.77,60.96 v67.31,63.5
PROC2_XTAL1
  Top 0.406: PROC2.9 58.42,50.8 Q2.1 55.88,53.34 55.88,57.15 C3.2
PROC2_XTAL2
  Top 0.406: PROC2.10 58.42,48.26 Q2.2 56.3,46.14 C4.2
UART1_RX
  Bottom 0.406: U$1.CN10_33 82.55,40.64 81.28,80.01 80.64,80.64 29.84,80.64 26.67,77.47 26.67,68.58 27.94,67.31 PROC1.3
UART1_TX
  Bottom 0.406: PROC1.2 30.48,71.12 31.75,71.12 33.02,72.39 33.02,78.74 34.29,80.01 78.11,80.01 78.74,79.38 78.74,54.61 U$1.CN10_21
UART6_RX
  Bottom 0.406: PROC2.3 63.5,67.31 72.39,67.31 73.66,66.04 73.66,57.15 74.93,55.88 U$1.CN10_19
UART6_TX
  Top 0.406: PROC2.2 63.5,69.85 64.77,69.85 69.85,74.93 78.74,74.93 U$1.CN10_04

### Text on the board
tNames: protofactory.co.za | SCL | SDA | D9 | D8 | D7 | D6 | D5 | D4 | D3 | D2 | D1 | GND
bNames: tom van den bon / July 2014 / will hack for beer